# EAGLE design Controller_pump_v1.0 (EAGLE 7.2.0)
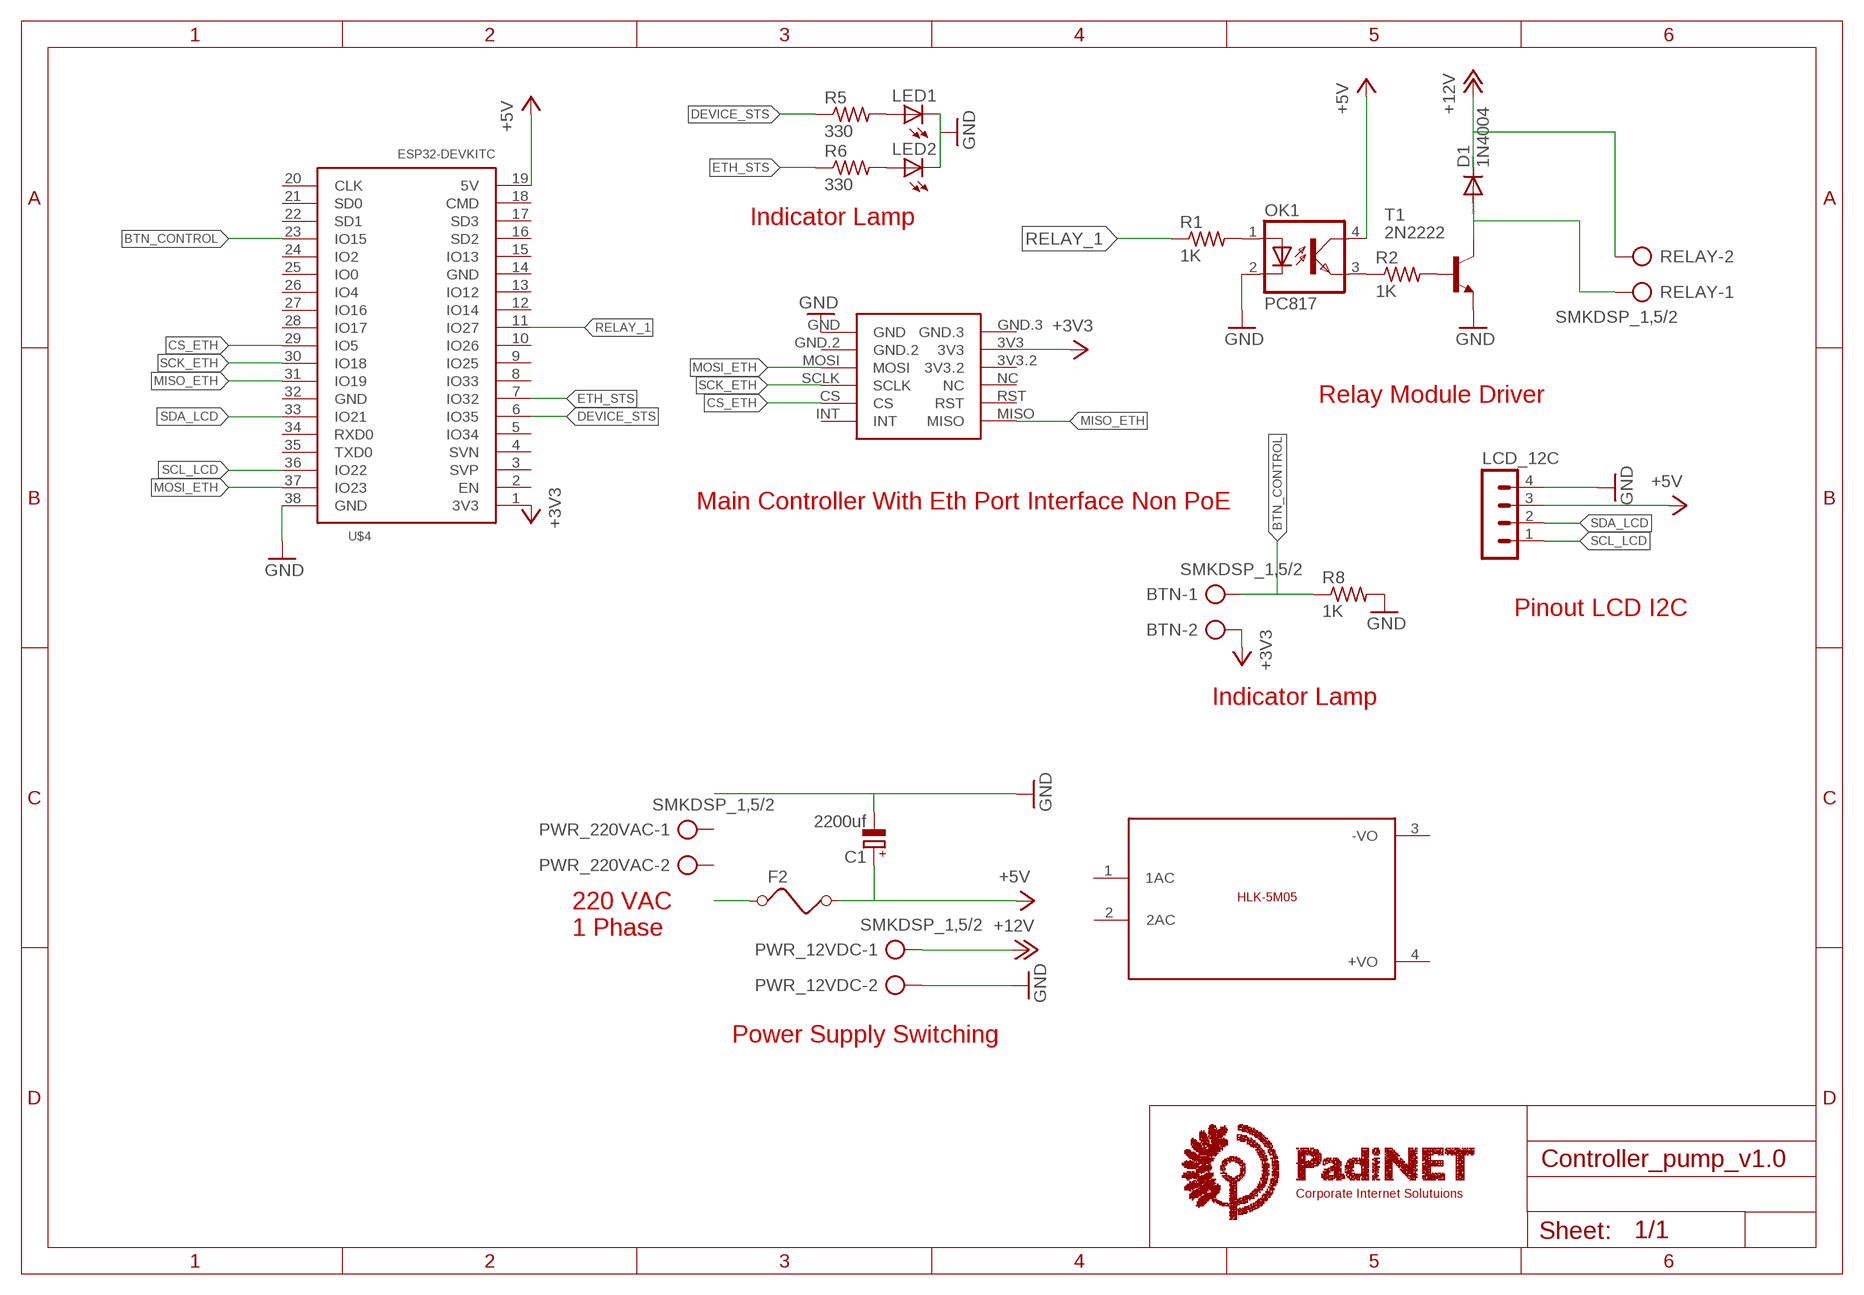
[diagram p0: schematic, sheet 1]

## Parts
BTN  SMKDSP_1,5/2  [SMKDSP_1,5/2]
C1  2200uf  CPOL-EUE5-13  [E5-13]
D1  1N4004  [DO41-10]
F2  FUSE  [FUSE]
LCD_12C  MA04-1  [MA04-1]
LED1  LED3MM  [LED3MM]
LED2  LED3MM  [LED3MM]
OK1  PC817  [DIL04]
PWR_12VDC  SMKDSP_1,5/2  [SMKDSP_1,5/2]
PWR_220VAC  SMKDSP_1,5/2  [SMKDSP_1,5/2]
R1  1K  R-US_0207/12  [0207/12]
R2  1K  R-US_0207/12  [0207/12]
R5  330  R-US_0207/12  [0207/12]
R6  330  R-US_0207/12  [0207/12]
R8  1K  R-US_0207/12  [0207/12]
RELAY  SMKDSP_1,5/2  [SMKDSP_1,5/2]
T1  2N2222  [TO18]
U$1  5VDC/5W  HLK-5M05  [HLK-5M05]
U$3  MINI_W5500  [MINI_W5500]
U$4  ESP32DEVKITC  [ESP32-DEVKITC]

## Nets
+3V3: BTN.2 U$3.3V3 U$4.1(3V3)
+5V: C1.+ F2.2 LCD_12C.3 OK1.4(COL) U$4.19(5V)
+12V: D1.C PWR_12VDC.1 RELAY.2
BTN_CONTROL: BTN.1 R8.1 U$4.23(IO15)
CS_ETH: U$3.CS U$4.29(IO5)
DEVICE_STS: R5.1 U$4.6(IO35)
ETH_STS: R6.1 U$4.7(IO32)
GND: C1.- LCD_12C.4 LED1.K(C) LED2.K(C) OK1.2(C) PWR_12VDC.2 R8.2 T1.1(E) U$3.GND U$4.38(GND)
MISO_ETH: U$3.MISO U$4.31(IO19)
MOSI_ETH: U$3.MOSI U$4.37(IO23)
N$3: D1.A RELAY.1 T1.3(C)
N$6: R2.2 T1.2(B)
N$9: OK1.3(EMIT) R2.1
N$10: OK1.1(A) R1.2
N$11: LED1.A R5.2
N$12: LED2.A R6.2
N$26: F2.1
RELAY_1: R1.1 U$4.11(IO27)
SCK_ETH: U$3.SCLK U$4.30(IO18)
SCL_LCD: LCD_12C.1 U$4.36(IO22)
SDA_LCD: LCD_12C.2 U$4.33(IO21)
Unconnected: PWR_220VAC.1 PWR_220VAC.2 U$1.1(1AC) U$1.2(2AC) U$1.3(-VO) U$1.4(+VO) U$3.3V3.2 U$3.GND.2 U$3.GND.3 U$3.INT U$3.NC U$3.RST U$4.2(EN) U$4.3(SVP) U$4.4(SVN) U$4.5(IO34) U$4.8(IO33) U$4.9(IO25) U$4.10(IO26) U$4.12(IO14) U$4.13(IO12) U$4.14(GND) U$4.15(IO13) U$4.16(SD2) U$4.17(SD3) U$4.18(CMD) U$4.20(CLK) U$4.21(SD0) U$4.22(SD1) U$4.24(IO2) U$4.25(IO0) U$4.26(IO4) U$4.27(IO16) U$4.28(IO17) U$4.32(GND) U$4.34(RXD0) U$4.35(TXD0)

## Notes on the sheet
- Indicator Lamp
- Relay Module Driver
- Main Controller With Eth Port Interface Non PoE
- Pinout LCD I2C
- Indicator Lamp
- 220 VAC 
  1 Phase
- Power Supply Switching
- Corporate Internet Solutuions

## Library data of the parts
BTN PWR_12VDC PWR_220VAC RELAY = con-phoenix-smkdsp:SMKDSP_1,5/2: Printklemme, Nennstrom: 17,5 A, Bemessungsspannung: 250 V, Raster: 5,0 mm Source: http://eshop.phoenixcontact.de .. 1733415.pdf; MF: FARNELL; MPN: 1733570; OC_FARNELL: 3041244; OC_NEWARK: 69C8588
C1 = resistor:CPOL-EU: POLARIZED CAPACITOR, European symbol
D1 = diode:1N4004: DIODE general purpose rectifier, 1 A
F2 = special:FUSE: FUSE 5 x 20 mm
LCD_12C = con-lstb:MA04-1: PIN HEADER; OC_FARNELL: unknown; OC_NEWARK: unknown
LED1 LED2 = led:LED: LED OSRAM: - CHIPLED LG R971, LG N971, LY N971, LG Q971, LY Q971, LO R971, LY R971 LH N974, LH R974 LS Q976, LO Q976, LY Q976 LO Q996 - Hyper CHIPLED LW Q18S LB Q993, LB Q99A, LB R99A - SideLED LS A670, LO A670, LY A670, LG A670, LP A670 LB A673, LV A673, LT A673, LW A673 LH A674 LY A675 LS A676, LA A676, LO A676, LY A676, LW A676 LS A679, LY A679, LG A679 - Hyper Micro SIDELED® LS Y876, LA Y876, LO Y876, LY Y876 LT Y87S - SmartLED LW L88C, LW L88S LB L89C, LB L89S, LG L890 LS L89K, LO L89K, LY L89K LS L896, LA L896, LO L896, LY L896 - TOPLED LS T670, LO T670, LY T670, LG T670, LP T670 LSG T670, LSP T670, LSY T670, LOP T670, LYG T670 LG T671, LOG T671, LSG T671 LB T673, LV T673, LT T673, LW T673 LH T674 LS T676, LA T676, LO T676, LY T676, LB T676, LH T676, LSB T676, LW T676 LB T67C, LV T67C, LT T67C, LS T67K, LO T67K, LY T67K, LW E67C LS E67B, LA E67B, LO E67B, LY E67B, LB E67C, LV E67C, LT E67C LW T67C LS T679, LY T679, LG T679 LS T770, LO T770, LY T770, LG T770, LP T770 LB T773, LV T773, LT T773, LW T773 LH T774 LS E675, LA E675, LY E675, LS T675 LS T776, LA T776, LO T776, LY T776, LB T776 LHGB T686 LT T68C, LB T68C - Hyper Mini TOPLED® LB M676 - Mini TOPLED Santana® LG M470 LS M47K, LO M47K, LY M47K Source: http://www.osram.convergy.de LUXEON: - LUMILED® LXK2-PW12-R00, LXK2-PW12-S00, LXK2-PW14-U00, LXK2-PW14-V00 LXK2-PM12-R00, LXK2-PM12-S00, LXK2-PM14-U00 LXK2-PE12-Q00, LXK2-PE12-R00, LXK2-PE12-S00, LXK2-PE14-T00, LXK2-PE14-U00 LXK2-PB12-K00, LXK2-PB12-L00, LXK2-PB12-M00, LXK2-PB14-N00, LXK2-PB14-P00, LXK2-PB14-Q00 LXK2-PR12-L00, LXK2-PR12-M00, LXK2-PR14-Q00, LXK2-PR14-R00 LXK2-PD12-Q00, LXK2-PD12-R00, LXK2-PD12-S00 LXK2-PH12-R00, LXK2-PH12-S00 LXK2-PL12-P00, LXK2-PL12-Q00, LXK2-PL12-R00 Source: www.luxeon.com KINGBRIGHT: KA-3528ASYC Source: www.kingbright.com
OK1 = optocoupler:PC817: SHARP OPTO COUPLER; MPN: PC817X4J000F; OC_FARNELL: 9707727; OC_NEWARK: 97K7059
R1 R2 R5 R6 R8 = resistor:R-US_: RESISTOR, American symbol
T1 = transistor:2N2222: NPN TRANSISTOR
U$1 = HLK-5M05:HLK-5M05: HLK-5M05 is an 5Volt/5W smps developed by HI-LINK; SIZE: 23x38(mm)
U$3 = ethernet-mikroavr:MINI_W5500: MINI ETHERNET W5500, CREATE BY MIKROAVR.COM
U$4 = ESP32-DEVKITC:ESP32DEVKITC

## Board
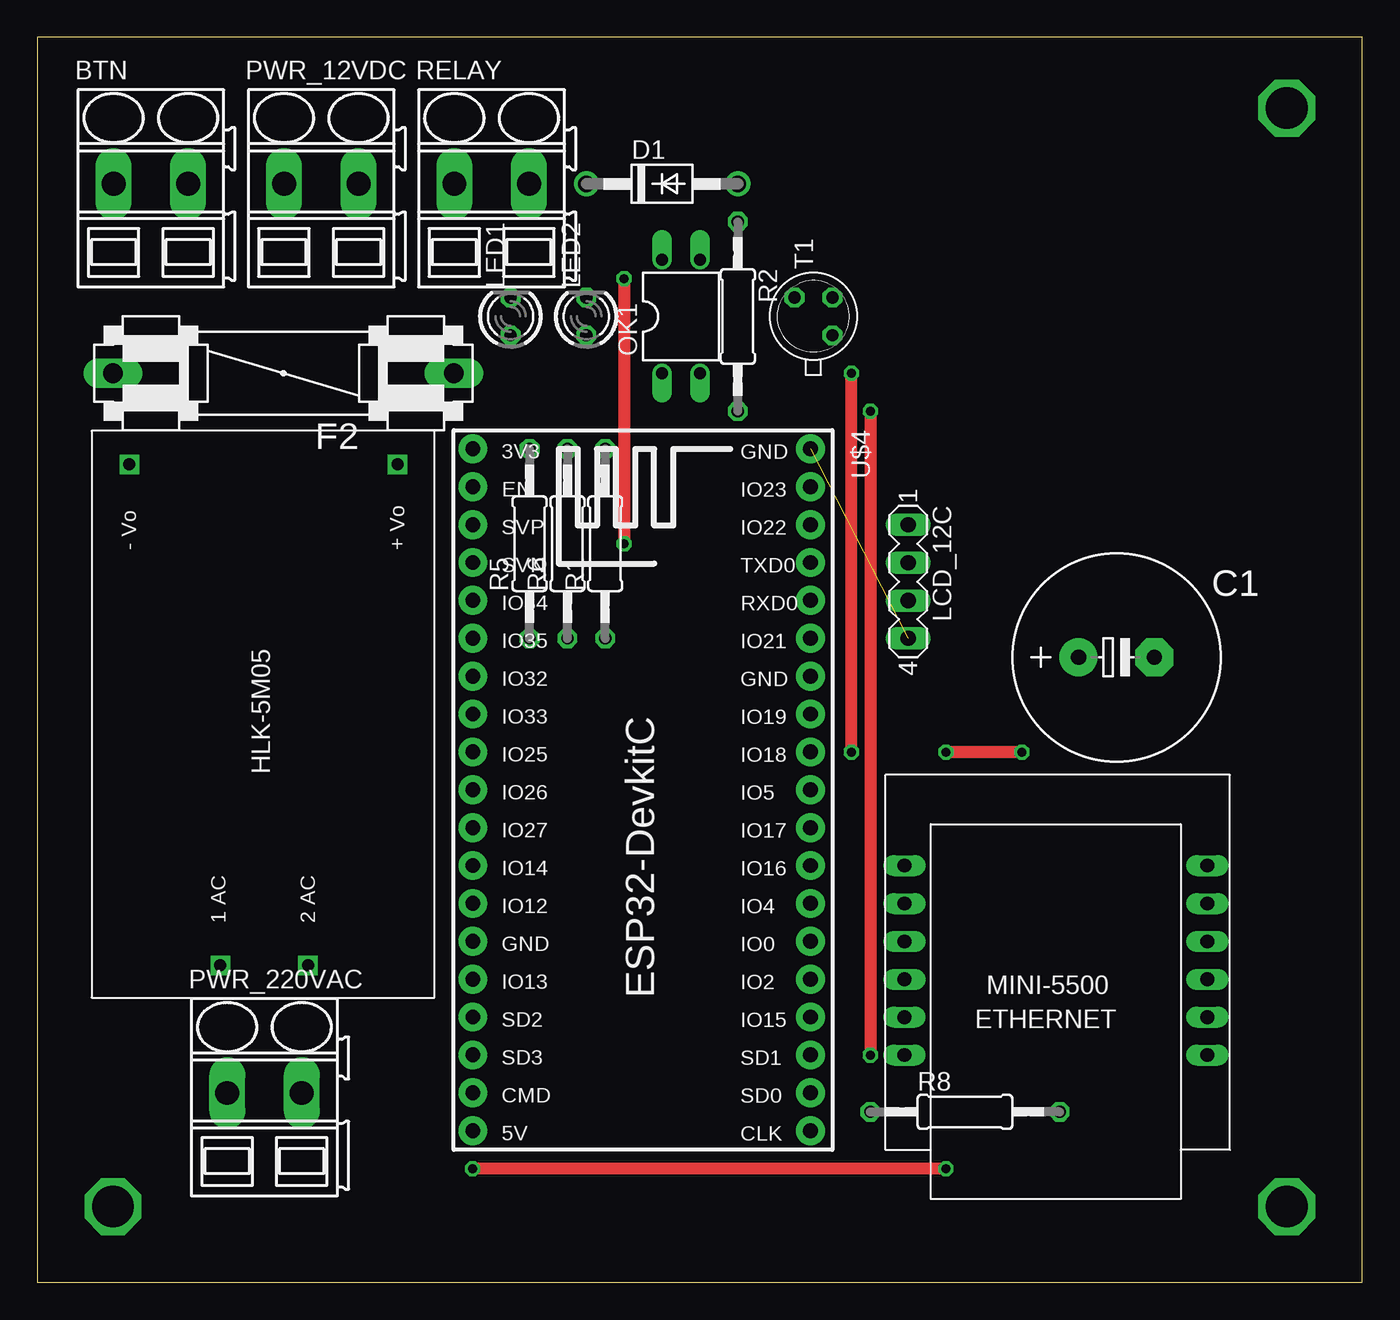
[diagram p1: board, top side]
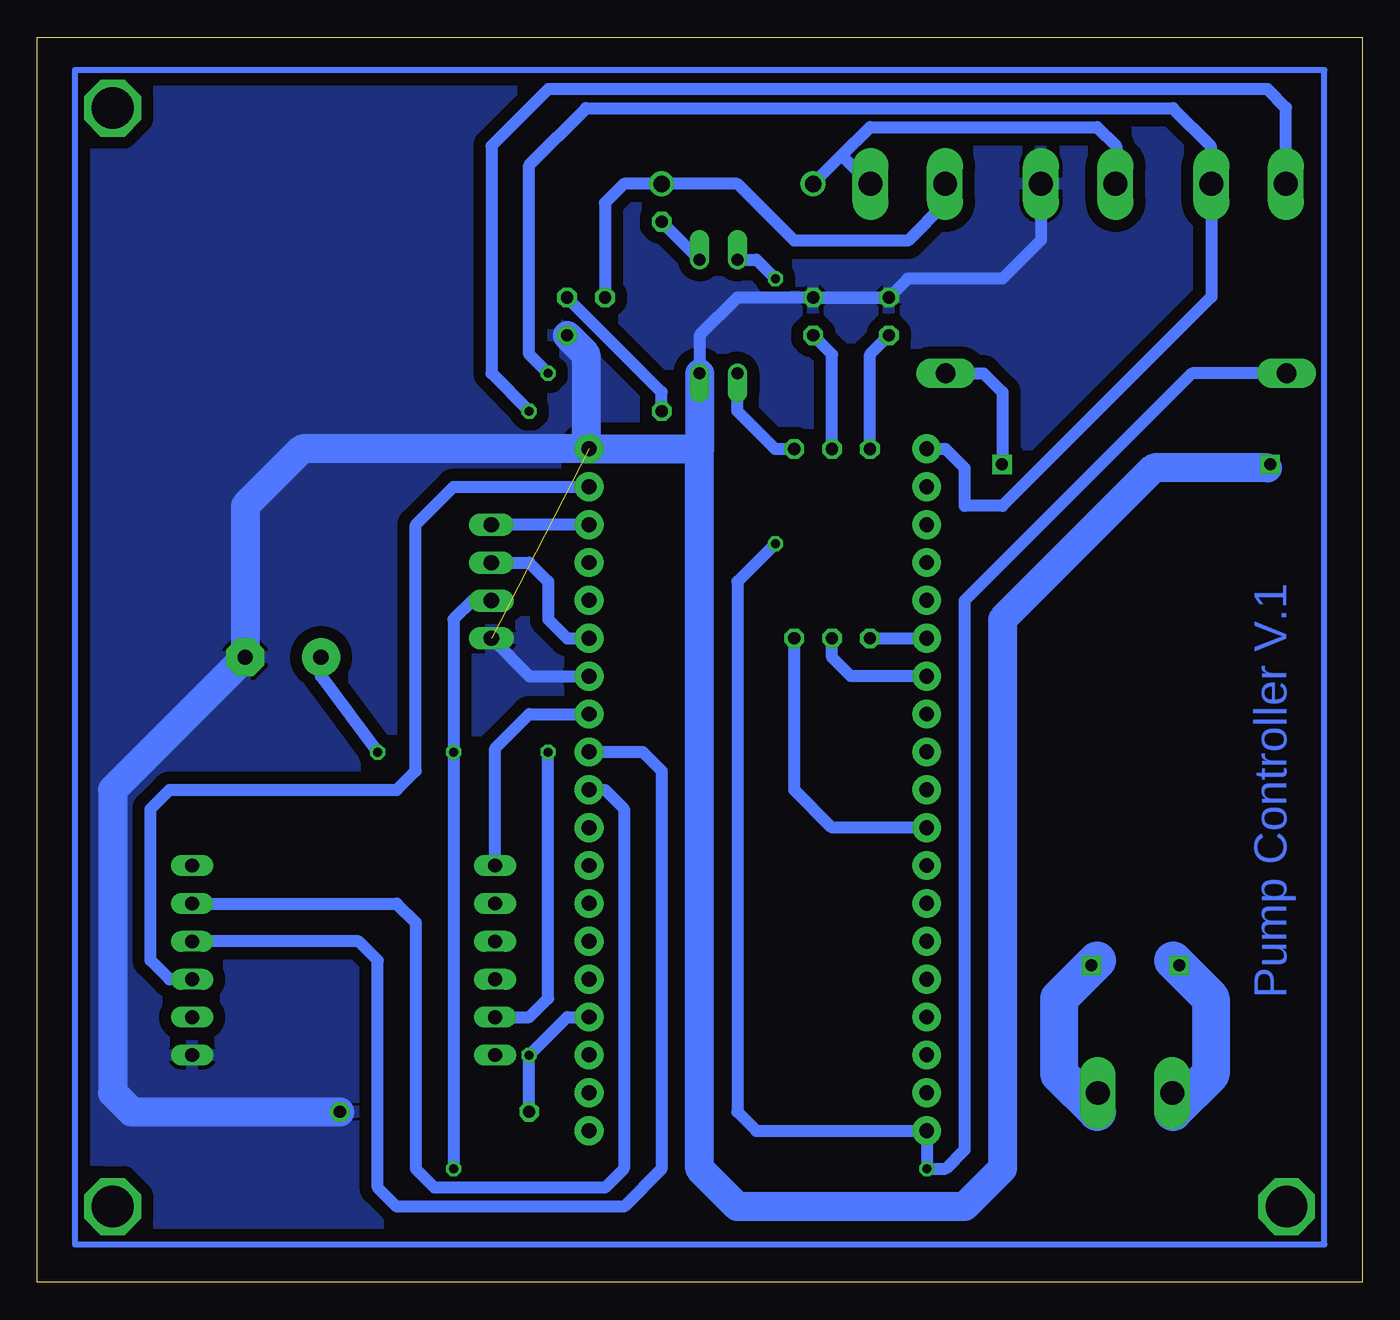
[diagram p2: board, bottom side, seen from below]

Size 88.88 x 83.49 mm. Coordinates in mm from the lower left corner, seen from the top.
Outline: 0,0 88.88,0 88.88,83.49 0,83.49 0,0
Copper layers (1*16): Top 0.035mm / dielectric 1.5mm / Bottom 0.035mm
Design rules "default": minimum track width 10mil, minimum drill 24mil, track to track 8mil, track to pad 8mil, pad to pad 8mil, via to via 8mil, smd to smd 8mil, copper to edge 40mil, drill to drill 8mil, minimum pad ring 10mil, minimum via ring 8mil, stop-mask expansion 4mil, vias tented up to drill 0mil, thermal gap 10mil

### Footprints (pad centres in the part's own frame; a part is rotated, then mirrored left to right if it is on the bottom)
SMKDSP_1,5/2 = drill 1.6 pad 1.8 long: 1 -2.5,0; 2 2.5,0
E5-13 = drill 1.016 pad 2.54: + -2.54,0 | drill 1.016 pad 2.54 octagon: - 2.54,0
DO41-10 = drill 1.118: A 5.08,0; C -5.08,0
FUSE = drill 1.321 long: 1 -11.43,0; 2 11.43,0
MA04-1 = drill 1.016 long: 1 -3.81,0; 2 -1.27,0; 3 1.27,0; 4 3.81,0
LED3MM = drill 0.813 octagon: A -1.27,0; K 1.27,0
DIL04 = drill 0.813 offset: 1 -1.27,-3.81; 2 1.27,-3.81; 3 1.27,3.81; 4 -1.27,3.81
0207/12 = drill 0.813 octagon: 1 -6.35,0; 2 6.35,0
TO18 = drill 0.813 octagon: 1 -1.27,-1.27; 2 1.27,-1.27; 3 1.27,1.27
HLK-5M05 = drill 0.8 square: 1 -16.85,-2.93; 2 -16.85,2.97; 3 16.75,9.07; 4 16.75,-8.93
MINI_W5500 = drill 0.914 long: 3V3 21.844,-8.89; 3V3.2 21.844,-11.43; CS 1.524,-16.51; GND 1.524,-6.35; GND.2 1.524,-8.89; GND.3 21.844,-6.35; INT 1.524,-19.05; MISO 21.844,-19.05; MOSI 1.524,-11.43; NC 21.844,-13.97; RST 21.844,-16.51; SCLK 1.524,-13.97
ESP32-DEVKITC = drill 1 pad 1.93: 1 -22.87,-11.42; 2 -20.33,-11.42; 3 -17.79,-11.42; 4 -15.25,-11.42; 5 -12.71,-11.42; 6 -10.17,-11.42; 7 -7.63,-11.42; 8 -5.09,-11.42; 9 -2.55,-11.42; 10 -0.01,-11.42; 11 2.53,-11.42; 12 5.07,-11.42; 13 7.61,-11.42; 14 10.15,-11.42; 15 12.69,-11.42; 16 15.23,-11.42; 17 17.77,-11.42; 18 20.31,-11.42; 19 22.85,-11.42; 20 22.85,11.23; 21 20.31,11.23; 22 17.77,11.23; 23 15.23,11.23; 24 12.69,11.23; 25 10.15,11.23; 26 7.61,11.23; 27 5.07,11.23; 28 2.53,11.23; 29 -0.01,11.23; 30 -2.55,11.23; 31 -5.09,11.23; 32 -7.63,11.23; 33 -10.17,11.23; 34 -12.71,11.23; 35 -15.25,11.23; 36 -17.79,11.23; 37 -20.33,11.23; 38 -22.87,11.23

### Placement (x,y rotation side)
BTN  7.62,73.66 0 top
C1  72.39,41.91 0 top
D1  41.91,73.66 0 top
F2  16.51,60.96 180 top
LCD_12C  58.42,46.99 270 top
LED1  31.75,64.77 90 top
LED2  36.83,64.77 90 top
OK1  43.18,64.77 0 top
PWR_12VDC  19.05,73.66 0 top
PWR_220VAC  15.24,12.7 0 top
R1  38.1,49.53 90 top
R2  46.99,64.77 270 top
R5  33.02,49.53 90 top
R6  35.56,49.53 90 top
R8  62.23,11.43 0 top
RELAY  30.48,73.66 0 top
T1  52.07,64.77 90 top
U$1  15.24,38.1 90 top
U$3  80.01,8.89 180 top
U$4  40.64,33.02 270 top

### Tracks (layer width: path | path; a pad name or v marks a point on that pad's centre or on a via)
+3V3  (via drill 0.6)
  Top 0.813: v54.61,35.56 v54.61,60.96
  Bottom 0.813: U$4.1 27.95,55.89 26.67,54.61 26.67,52.07 24.13,52.07 10.12,66.08 BTN.2 10.16,73.7 10.16,76.2 12.7,78.74 52.07,78.74 55.88,74.93 55.88,62.23 v54.61,60.96 | U$3.3V3 55.88,17.78 54.61,19.05 v54.61,35.56
+5V  (via drill 0.6)
  Top 0.813: v60.96,7.62 v29.21,7.62 | v39.37,67.31 v39.37,49.53 | v66.04,35.56 v60.96,35.56
  Bottom 0.813: v60.96,7.62 v60.96,35.56 60.96,44.45 59.69,45.72 LCD_12C.3 | F2.2 11.43,60.96 26.67,45.72 26.67,8.89 27.94,7.62 v29.21,7.62 U$4.19 40.64,10.16 41.91,11.43 41.91,46.99 v39.37,49.53 | OK1.4 40.64,68.58 v39.37,67.31 | C1.+ 69.85,40.64 v66.04,35.56
+12V
  Bottom 0.813: D1.C 34.92,75.56 | 34.92,75.56 33.02,77.47 17.78,77.47 16.51,76.2 16.51,73.7 PWR_12VDC.1 | RELAY.2 33.02,73.66 34.92,75.56
BTN_CONTROL  (via drill 0.6)
  Top 0.813: v55.88,58.42 v55.88,15.24
  Bottom 0.813: R8.1 v55.88,15.24 53.34,17.78 U$4.23 | BTN.1 5.12,78.78 6.35,80.01 54.61,80.01 58.42,76.2 58.42,60.96 v55.88,58.42
CS_ETH
  Bottom 0.813: U$4.29 50.81,33.03 49.53,31.75 49.53,7.62 50.8,6.35 62.23,6.35 63.5,7.62 63.5,24.13 64.77,25.4 U$3.CS
DEVICE_STS
  Bottom 0.813: R5.1 U$4.6
ETH_STS
  Bottom 0.813: U$4.7 34.3,40.65 35.56,41.91 R6.1
GND  (1 unrouted)
  Bottom 0.813: LCD_12C.4 55.88,40.64 52.07,40.64 | LED2.K LED1.K | LED1.K 41.91,66.04 44.45,63.5 OK1.2 44.45,55.88 44.46,55.89 U$4.38 | PWR_12VDC.2 21.55,69.89 24.13,67.31 30.48,67.31 LED1.K
  Bottom 1.93: T1.1 52.07,62.23 52.07,56.09 U$4.38 71.11,55.89 74.93,52.07 C1.- 83.82,33.02 83.82,12.7 82.55,11.43 R8.2
  pour Bottom (isolate 0.813): 2.54,81.28 86.36,81.28 86.36,2.54 2.54,2.54
MISO_ETH
  Bottom 0.813: U$3.MISO 58.17,35.81 55.88,38.1 U$4.31
MOSI_ETH
  Bottom 0.813: U$3.MOSI 80.01,20.32 81.28,21.59 81.28,31.75 80.01,33.02 64.77,33.02 63.5,34.29 63.5,50.8 60.96,53.34 U$4.37
N$1
  Bottom 2.54: 12.7,21.59 10.16,19.05 10.16,13.97 12.7,11.43
N$2
  Bottom 1.93: 6.35,54.61 13.97,54.61 24.13,44.45 24.13,7.62 26.67,5.08 41.91,5.08 44.45,7.62 44.45,55.88 | 44.45,60.96 44.45,55.88 | 44.45,55.88 52.07,55.88
N$3
  Bottom 0.813: T1.3 50.8,72.39 49.53,73.66 D1.A 41.91,73.66 38.1,69.85 30.48,69.85 27.98,72.35 RELAY.1
N$4
  Bottom 2.54: 17.78,11.43 20.32,13.97 20.32,19.05 17.78,21.59
N$6
  Bottom 0.813: R2.2 46.99,59.69 T1.2
N$9
  Bottom 0.813: OK1.3 R2.1
N$10
  Bottom 0.813: R1.2 39.37,55.88 41.91,58.42 OK1.1
N$11
  Bottom 0.813: R5.2 33.02,62.23 LED1.A
N$12
  Bottom 0.813: R6.2 35.56,62.23 LED2.A
N$15  (via drill 2.8 pad 3.81)
  other vias: 5.08,5.08
N$17  (via drill 2.8 pad 3.81)
  other vias: 83.82,78.74
N$18  (via drill 2.8 pad 3.81)
  other vias: 83.82,5.08
N$20
  Bottom 0.406: 86.36,81.28 86.36,2.54 2.54,2.54 2.54,81.28 86.36,81.28
N$26
  Bottom 0.813: F2.1 25.4,60.96 24.13,59.69 24.13,54.61
RELAY_1
  Bottom 0.813: U$4.11 35.57,30.49 38.1,33.02 R1.1
SCK_ETH
  Bottom 0.813: U$4.30 48.27,35.57 46.99,34.29 46.99,7.62 49.53,5.08 64.77,5.08 66.04,6.35 66.04,21.59 67.31,22.86 U$3.SCLK 78.74,22.86
SCL_LCD
  Bottom 0.813: U$4.36 57.14,50.81 LCD_12C.1
SDA_LCD
  Bottom 0.813: LCD_12C.2 55.88,48.26 54.61,46.99 54.61,44.45 53.34,43.18 U$4.33

### Text on the board
Bottom: Pump Controller V.1